# Altium project Austindetz_CM4_Board_v1.0.PrjPcb (part 2 of 2)

## Sheet Sheet4.SchDoc
size A3
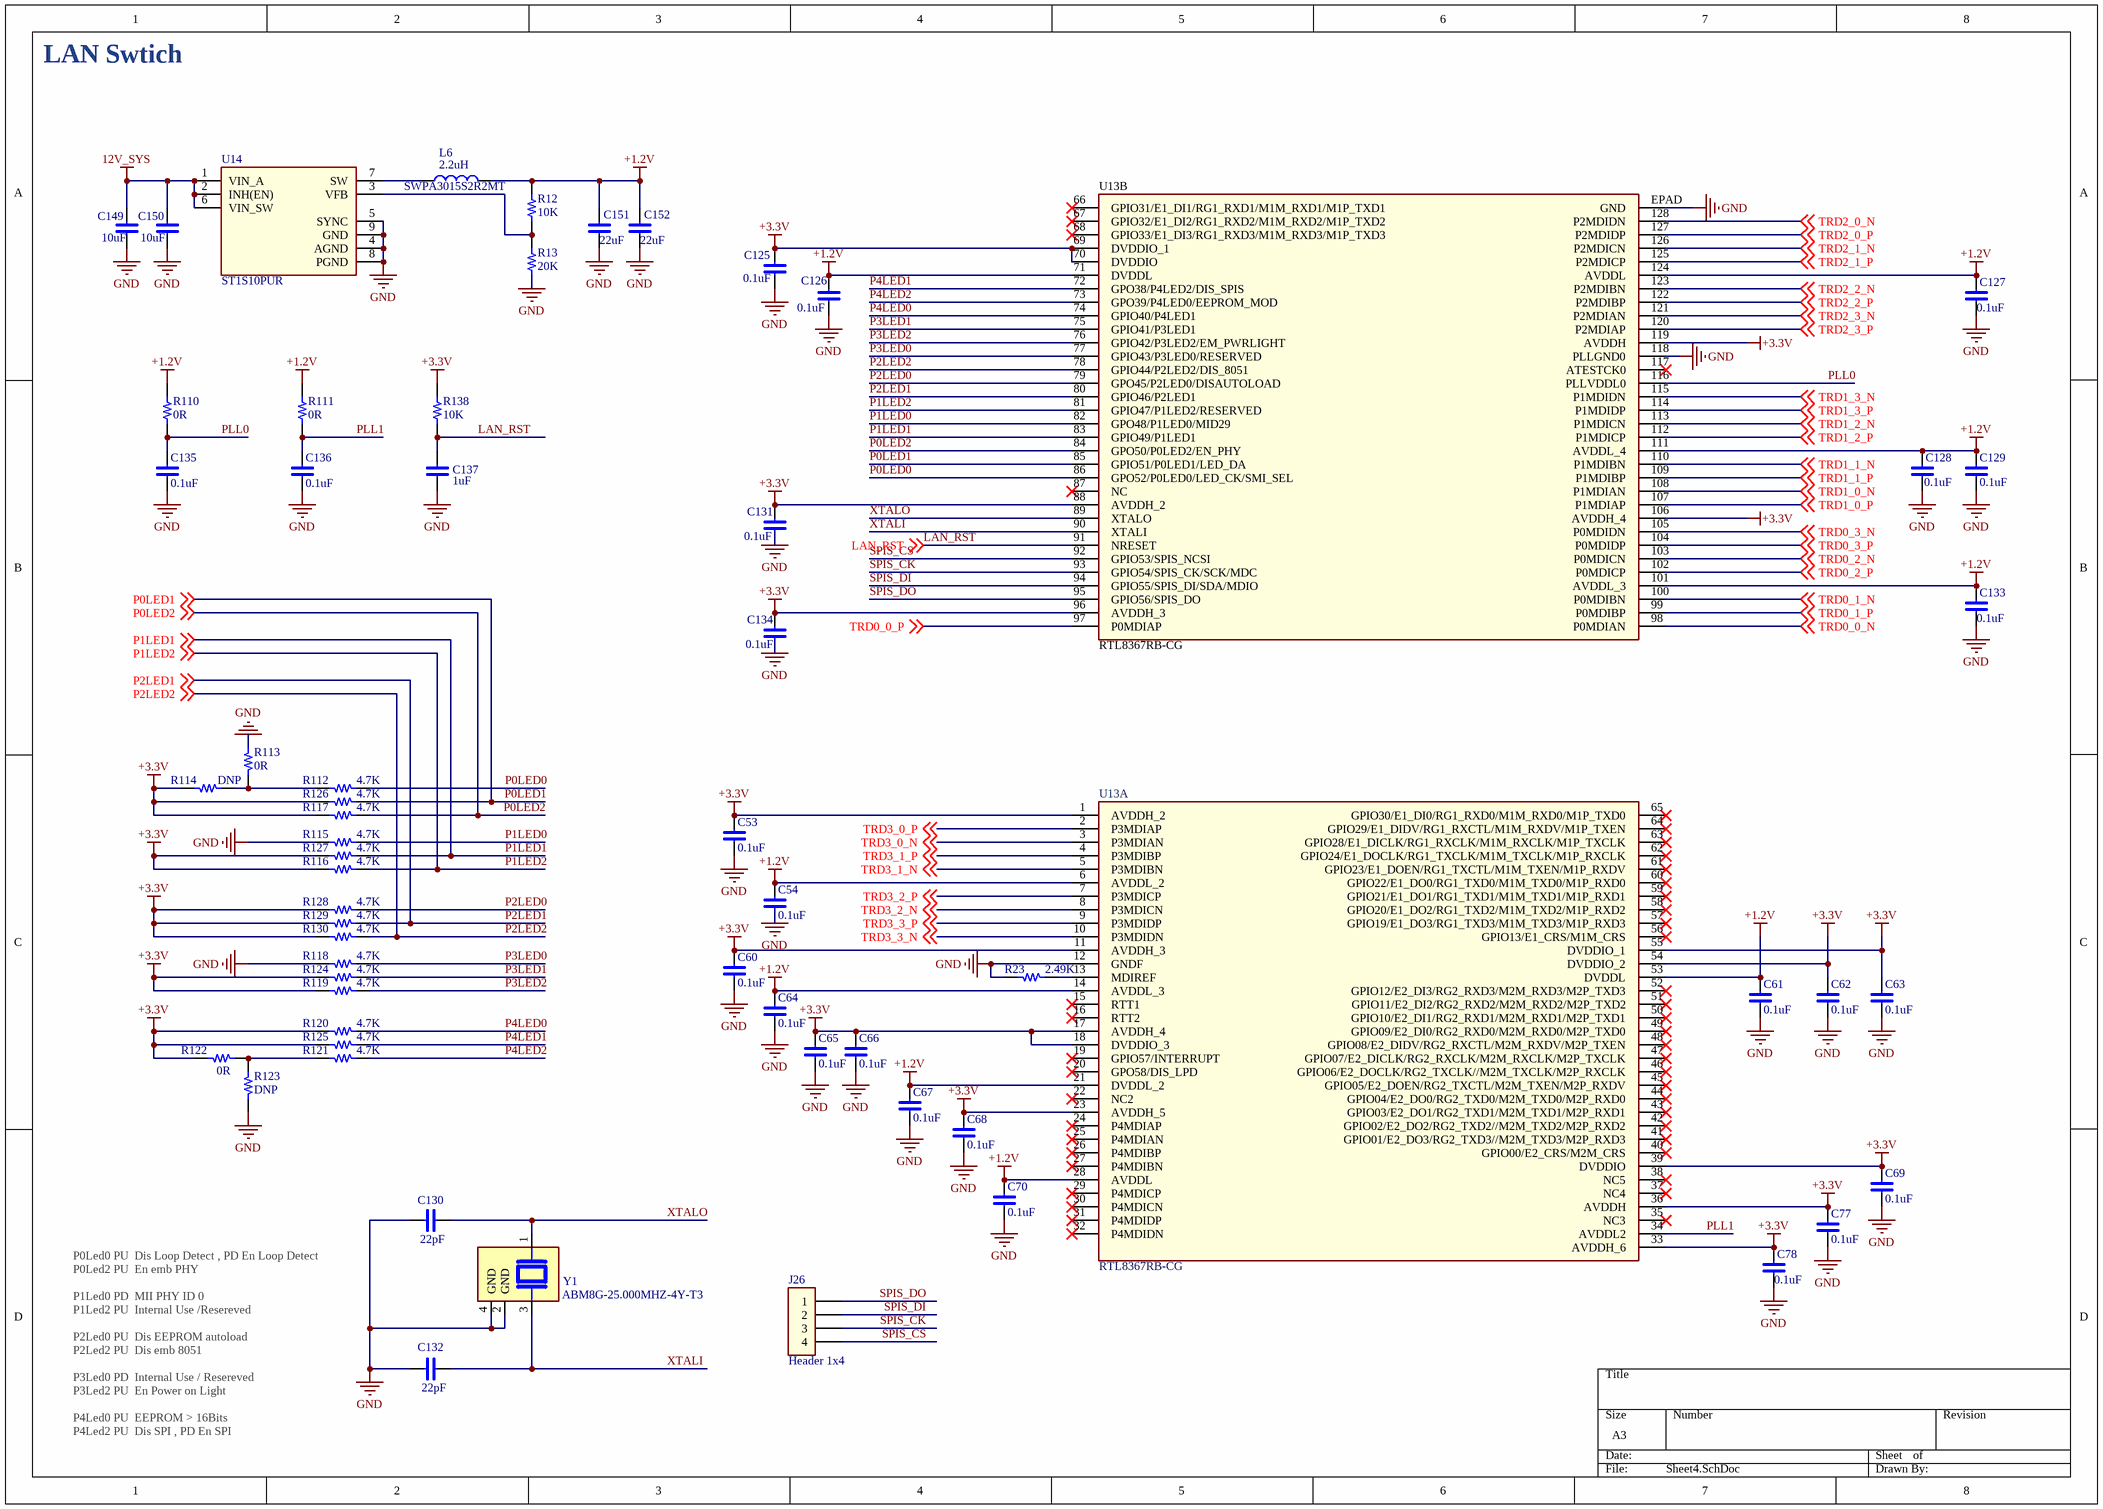
[diagram p3: Sheet4.SchDoc]

### Parts
C53  0.1uF  [C-0402/1005]
C54  0.1uF  [C-0402/1005]
C60  0.1uF  [C-0402/1005]
C61  0.1uF  [C-0402/1005]
C62  0.1uF  [C-0402/1005]
C63  0.1uF  [C-0402/1005]
C64  0.1uF  [C-0402/1005]
C65  0.1uF  [C-0402/1005]
C66  0.1uF  [C-0402/1005]
C67  0.1uF  [C-0402/1005]
C68  0.1uF  [C-0402/1005]
C69  0.1uF  [C-0402/1005]
C70  0.1uF  [C-0402/1005]
C77  0.1uF  [C-0402/1005]
C78  0.1uF  [C-0402/1005]
C125  0.1uF  [C-0402/1005]
C126  0.1uF  [C-0402/1005]
C127  0.1uF  [C-0402/1005]
C128  0.1uF  [C-0402/1005]
C129  0.1uF  [C-0402/1005]
C130  22pF  [C-0402/1005]
C131  0.1uF  [C-0402/1005]
C132  22pF  [C-0402/1005]
C133  0.1uF  [C-0402/1005]
C134  0.1uF  [C-0402/1005]
C135  0.1uF  [C-0402/1005]
C136  0.1uF  [C-0402/1005]
C137  1uF  [C-0402/1005]
C149  10uF  [C-0805/2012]
C150  10uF  [C-0805/2012]
C151  22uF  [C-0805/2012]
C152  22uF  [C-0805/2012]
J26  Header 1x4  [PIN HEADER 1x4 2.54mm]
L6  SWPA3015S2R2MT  value 2.2uH  [SWPA3015S2R2MT]
R12  10K  [R-0402/1005]
R13  20K  [R-0402/1005]
R23  2.49K  [R-0402/1005]
R110  0R  [R-0402/1005]
R111  0R  [R-0402/1005]
R112  4.7K  [R-0402/1005]
R113  0R  [R-0402/1005]
R114  DNP  [R-0402/1005]
R115  4.7K  [R-0402/1005]
R116  4.7K  [R-0402/1005]
R117  4.7K  [R-0402/1005]
R118  4.7K  [R-0402/1005]
R119  4.7K  [R-0402/1005]
R120  4.7K  [R-0402/1005]
R121  4.7K  [R-0402/1005]
R122  0R  [R-0402/1005]
R123  DNP  [R-0402/1005]
R124  4.7K  [R-0402/1005]
R125  4.7K  [R-0402/1005]
R126  4.7K  [R-0402/1005]
R127  4.7K  [R-0402/1005]
R128  4.7K  [R-0402/1005]
R129  4.7K  [R-0402/1005]
R130  4.7K  [R-0402/1005]
R138  10K  [R-0402/1005]
U13  RTL8367RB-CG  [LQFP128_EPAD_RTK]  (parts A,B of 2)
U14  ST1S10PUR  [DFN8_4X4_STM]
Y1  ABM8G-25.000MHZ-4Y-T3  [XTAL_ABM8G-25.000MHZ-4Y-T3]

### Nets
12V_SYS: C149.1 C150.1 U14.1(VIN_A) U14.2(INH(EN)) U14.6(VIN_SW)
+1.2V: C54.1 C61.1 C64.1 C67.1 C70.1 C126.1 C127.1 C128.1 C129.1 C133.1 C151.1 C152.1 L6.2 R12.2 R110.2 R111.2 U13.6(AVDDL_2) U13.14(AVDDL_3) U13.21(DVDDL_2) U13.28(AVDDL) U13.53(DVDDL) U13.71(DVDDL) U13.101(AVDDL_3) U13.111(AVDDL_4) U13.124(AVDDL)
+3.3V: C53.1 C60.1 C62.1 C63.1 C65.1 C66.1 C68.1 C69.1 C77.1 C78.1 C125.1 C131.1 C134.1 R114.2 R116.2 R117.2 R119.2 R120.2 R122.2 R124.2 R125.2 R126.2 R127.2 R128.2 R129.2 R130.2 R138.2 U13.1(AVDDH_2) U13.11(AVDDH_3) U13.17(AVDDH_4) U13.18(DVDDIO_3) U13.23(AVDDH_5) U13.33(AVDDH_6) U13.36(AVDDH) U13.39(DVDDIO) U13.54(DVDDIO_2) U13.55(DVDDIO_1) U13.69(DVDDIO_1) U13.70(DVDDIO) U13.88(AVDDH_2) U13.96(AVDDH_3) U13.106(AVDDH_4) U13.119(AVDDH)
GND: C53.2 C54.2 C60.2 C61.2 C62.2 C63.2 C64.2 C65.2 C66.2 C67.2 C68.2 C69.2 C70.2 C77.2 C78.2 C125.2 C126.2 C127.2 C128.2 C129.2 C130.1 C131.2 C132.1 C133.2 C134.2 C135.2 C136.2 C137.2 C149.2 C150.2 C151.2 C152.2 R13.2 R23.2 R113.2 R115.2 R118.2 R123.2 U13.12(GNDF) U13.118(PLLGND0) U13.EPAD(GND) U14.4(AGND) U14.5(SYNC) U14.8(PGND) U14.9(GND) Y1.2(GND) Y1.4(GND)
LAN_RST: C137.1 R138.1 U13.91(NRESET) ; off-sheet LAN_RST
P0LED0: R112.1 U13.86(GPO52/P0LED0/LED_CK/SMI_SEL)
P0LED1: R126.1 U13.85(GPIO51/P0LED1/LED_DA) ; off-sheet P0LED1
P0LED2: R117.1 U13.84(GPO50/P0LED2/EN_PHY) ; off-sheet P0LED2
P1LED0: R115.1 U13.82(GPO48/P1LED0/MID29)
P1LED1: R127.1 U13.83(GPIO49/P1LED1) ; off-sheet P1LED1
P1LED2: R116.1 U13.81(GPIO47/P1LED2/RESERVED) ; off-sheet P1LED2
P2LED0: R128.1 U13.79(GPO45/P2LED0/DISAUTOLOAD)
P2LED1: R129.1 U13.80(GPIO46/P2LED1) ; off-sheet P2LED1
P2LED2: R130.1 U13.78(GPIO44/P2LED2/DIS_8051) ; off-sheet P2LED2
P3LED0: R118.1 U13.77(GPIO43/P3LED0/RESERVED)
P3LED1: R124.1 U13.75(GPIO41/P3LED1)
P3LED2: R119.1 U13.76(GPIO42/P3LED2/EM_PWRLIGHT)
P4LED0: R120.1 U13.74(GPIO40/P4LED1)
P4LED1: R125.1 U13.72(GPO38/P4LED2/DIS_SPIS)
P4LED2: R121.1 U13.73(GPO39/P4LED0/EEPROM_MOD)
PLL0: C135.1 R110.1 U13.116(PLLVDDL0)
PLL1: C136.1 R111.1 U13.34(AVDDL2)
SPIS_CK: J26.3 U13.93(GPIO54/SPIS_CK/SCK/MDC)
SPIS_CS: J26.4 U13.92(GPIO53/SPIS_NCSI)
SPIS_DI: J26.2 U13.94(GPIO55/SPIS_DI/SDA/MDIO)
SPIS_DO: J26.1 U13.95(GPIO56/SPIS_DO)
TRD0_0_N: U13.98(P0MDIAN) ; off-sheet TRD0_0_N
TRD0_0_P: U13.97(P0MDIAP) ; off-sheet TRD0_0_P
TRD0_1_N: U13.100(P0MDIBN) ; off-sheet TRD0_1_N
TRD0_1_P: U13.99(P0MDIBP) ; off-sheet TRD0_1_P
TRD0_2_N: U13.103(P0MDICN) ; off-sheet TRD0_2_N
TRD0_2_P: U13.102(P0MDICP) ; off-sheet TRD0_2_P
TRD0_3_N: U13.105(P0MDIDN) ; off-sheet TRD0_3_N
TRD0_3_P: U13.104(P0MDIDP) ; off-sheet TRD0_3_P
TRD1_0_N: U13.108(P1MDIAN) ; off-sheet TRD1_0_N
TRD1_0_P: U13.107(P1MDIAP) ; off-sheet TRD1_0_P
TRD1_1_N: U13.110(P1MDIBN) ; off-sheet TRD1_1_N
TRD1_1_P: U13.109(P1MDIBP) ; off-sheet TRD1_1_P
TRD1_2_N: U13.113(P1MDICN) ; off-sheet TRD1_2_N
TRD1_2_P: U13.112(P1MDICP) ; off-sheet TRD1_2_P
TRD1_3_N: U13.115(P1MDIDN) ; off-sheet TRD1_3_N
TRD1_3_P: U13.114(P1MDIDP) ; off-sheet TRD1_3_P
TRD2_0_N: U13.128(P2MDIDN) ; off-sheet TRD2_0_N
TRD2_0_P: U13.127(P2MDIDP) ; off-sheet TRD2_0_P
TRD2_1_N: U13.126(P2MDICN) ; off-sheet TRD2_1_N
TRD2_1_P: U13.125(P2MDICP) ; off-sheet TRD2_1_P
TRD2_2_N: U13.123(P2MDIBN) ; off-sheet TRD2_2_N
TRD2_2_P: U13.122(P2MDIBP) ; off-sheet TRD2_2_P
TRD2_3_N: U13.121(P2MDIAN) ; off-sheet TRD2_3_N
TRD2_3_P: U13.120(P2MDIAP) ; off-sheet TRD2_3_P
TRD3_0_N: U13.3(P3MDIAN) ; off-sheet TRD3_0_N
TRD3_0_P: U13.2(P3MDIAP) ; off-sheet TRD3_0_P
TRD3_1_N: U13.5(P3MDIBN) ; off-sheet TRD3_1_N
TRD3_1_P: U13.4(P3MDIBP) ; off-sheet TRD3_1_P
TRD3_2_N: U13.8(P3MDICN) ; off-sheet TRD3_2_N
TRD3_2_P: U13.7(P3MDICP) ; off-sheet TRD3_2_P
TRD3_3_N: U13.10(P3MDIDN) ; off-sheet TRD3_3_N
TRD3_3_P: U13.9(P3MDIDP) ; off-sheet TRD3_3_P
XTALI: C132.2 U13.90(XTALI) Y1.3
XTALO: C130.2 U13.89(XTALO) Y1.1
NetL6_1: L6.1 U14.7(SW)
NetR12_1: R12.1 R13.1 U14.3(VFB)
NetR23_1: R23.1 U13.13(MDIREF)
NetR112_2: R112.2 R113.1 R114.1
NetR121_2: R121.2 R122.1 R123.1

Not connected (* = marked no-connect by the designer): U13 15(RTT1)* 16(RTT2)* 19(GPIO57/INTERRUPT)* 20(GPO58/DIS_LPD)* 22(NC2)* 24(P4MDIAP)* 25(P4MDIAN)* 26(P4MDIBP)* 27(P4MDIBN)* 29(P4MDICP)* 30(P4MDICN)* 31(P4MDIDP)* 32(P4MDIDN)* 35(NC3)* 37(NC4)* 38(NC5)* 40(GPIO00/E2_CRS/M2M_CRS)* 41(GPIO01/E2_DO3/RG2_TXD3//M2M_TXD3/M2P_RXD3)* 42(GPIO02/E2_DO2/RG2_TXD2//M2M_TXD2/M2P_RXD2)* 43(GPIO03/E2_DO1/RG2_TXD1/M2M_TXD1/M2P_RXD1)* 44(GPIO04/E2_DO0/RG2_TXD0/M2M_TXD0/M2P_RXD0)* 45(GPIO05/E2_DOEN/RG2_TXCTL/M2M_TXEN/M2P_RXDV)* 46(GPIO06/E2_DOCLK/RG2_TXCLK//M2M_TXCLK/M2P_RXCLK)* 47(GPIO07/E2_DICLK/RG2_RXCLK/M2M_RXCLK/M2P_TXCLK)* 48(GPIO08/E2_DIDV/RG2_RXCTL/M2M_RXDV/M2P_TXEN)* 49(GPIO09/E2_DI0/RG2_RXD0/M2M_RXD0/M2P_TXD0)* 50(GPIO10/E2_DI1/RG2_RXD1/M2M_RXD1/M2P_TXD1)* 51(GPIO11/E2_DI2/RG2_RXD2/M2M_RXD2/M2P_TXD2)* 52(GPIO12/E2_DI3/RG2_RXD3/M2M_RXD3/M2P_TXD3)* 56(GPIO13/E1_CRS/M1M_CRS)* 57(GPIO19/E1_DO3/RG1_TXD3/M1M_TXD3/M1P_RXD3)* 58(GPIO20/E1_DO2/RG1_TXD2/M1M_TXD2/M1P_RXD2)* 59(GPIO21/E1_DO1/RG1_TXD1/M1M_TXD1/M1P_RXD1)* 60(GPIO22/E1_DO0/RG1_TXD0/M1M_TXD0/M1P_RXD0)* 61(GPIO23/E1_DOEN/RG1_TXCTL/M1M_TXEN/M1P_RXDV)* 62(GPIO24/E1_DOCLK/RG1_TXCLK/M1M_TXCLK/M1P_RXCLK)* 63(GPIO28/E1_DICLK/RG1_RXCLK/M1M_RXCLK/M1P_TXCLK)* 64(GPIO29/E1_DIDV/RG1_RXCTL/M1M_RXDV/M1P_TXEN)* 65(GPIO30/E1_DI0/RG1_RXD0/M1M_RXD0/M1P_TXD0)* 66(GPIO31/E1_DI1/RG1_RXD1/M1M_RXD1/M1P_TXD1)* 67(GPIO32/E1_DI2/RG1_RXD2/M1M_RXD2/M1P_TXD2)* 68(GPIO33/E1_DI3/RG1_RXD3/M1M_RXD3/M1P_TXD3)* 87(NC)* 117(ATESTCK0)*

### Notes on the sheet
- LAN Swtich
- P0Led0 PU  Dis Loop Detect , PD En Loop Detect
  P0Led2 PU  En emb PHY
  P1Led0 PD  MII PHY ID 0
  P1Led2 PU  Internal Use /Resereved
  P2Led0 PU  Dis EEPROM autoload
  P2Led2 PU  Dis emb 8051
  P3Led0 PD  Internal Use / Resereved
  P3Led2 PU  En Power on Light
  P4Led0 PU  EEPROM > 16Bits
  P4Led2 PU  Dis SPI , PD En SPI

### Library data of the parts
C53 C54 C60-C70 C77 C78 C125-C137 = Capacitor-NonPolar: CAP CER 0.1UF 16V X7R 0402; Mfr. Part No.: GCM155R71C104KA55D; Unit Price (USD): 0.1; Value: 0.1uF 16V; Supplier Part No.: 490-4759-1-ND; Supplier: Digikey Electronics
C149-C152 = CAP 1206/3216: CAP CER 10UF 25V X5R 1206; Mfr. Part No.: C1206C106M3PACTU; Unit Price (USD): 0.28; Supplier Part No.: 399-8153-1-ND; Supplier: Digikey Electronics
J26 = Header 1x4: CONN HEADER VERT 4POS 2.54MM; Supplier: Digikey Electronics
L6 = 4.3x4.3mm: FIXED IND 22UH 620MA 350 MOHM; Mfr. Part No.: ASPI-4020S-220M-T; Unit Price (USD): 0.48; Supplier Part No.: 535-12307-1-ND; Supplier: Digikey Electronics
R12 R13 R23 = Resistor: as R15 on sheet Sheet2; Supplier Part No.: P51DECT-ND; Supplier: Digikey Electronics
R110-R130 R138 = Resistor: RES SMD 1K OHM 1% 1/16W 0402; Mfr. Part No.: RC0402FR-071KL; Unit Price (USD): 0.1; Value: 1k; Supplier Part No.: 311-1.00KLRCT-ND; Supplier: Digikey Electronics
U13 = RTL8367RB-CG: MFR_NAME: Realtek; GateName_1: A; SymbolName_1: RTL8367RB-CG_PARTA; GateName_2: B; SymbolName_2: RTL8367RB-CG_PARTB; LibraryName: RTL8367RB; DeviceSetName: RTL8367RB-CG; Package: LQFP128_EPAD_RTK; COPYRIGHT: Copyright (C) 2023 Ultra Librarian. All rights reserved.; MANUFACTURER_PART_NUMBER: RTL8367RB-CG
U14 = ST1S10PUR: No Description Available; Mfr_Name: STMicroelectronics; RefDes: RefDes; Type: Type
Y1 = ABM8G-25.000MHZ-4Y-T3: 25 MHz Â±30ppm Crystal 10pF 60 Ohms 4-SMD, No Lead; MF: Abracon; Price: None; Value: *; Check_prices: https://www.snapeda.com/parts/ABM8G-25.000MHZ-4Y-T3/Abracon+LLC/view-part/?ref=eda; Purchase-URL: https://pricing.snapeda.com/search/part/ABM8G-25.000MHZ-4Y-T3/?ref=eda; Package: SMD-4 Abracon; SnapEDA_Link: https://www.snapeda.com/parts/ABM8G-25.000MHZ-4Y-T3/Abracon+LLC/view-part/?ref=snap; Availability: In Stock; MP: ABM8G-25.000MHZ-4Y-T3

## Sheet Sheet5.SchDoc
size A3; SPICEModelCacheJPNMEEMH: <root> / <DocumentId>JPNMEEMH</DocumentId> / <CacheFrame Number="0"> / <Model Name="zener" Kind="MDL"> / <Text>*ZENER / *Default Zener 10V @ 10mA / *Zener Diode Pinout: A,K / .MODEL ZENER D( BV=10 IBV=10E-3 )</Text> / </Model> / <Model Name="led0" Kind="MDL"> / <Text>*Typ INFRARED GaAs LED: Vf=1.2V Vr=5V If=40mA trr=3uS / *LED Pinout: 1=A, 2=K / .MODEL LED0 D (IS=93.5P RS=84M N=2.63 BV=5 IBV=10U / + CJO=2.97P VJ=.75 M=.333 TT=4.32U)</Text> / </Model> / </CacheFrame> / </root>
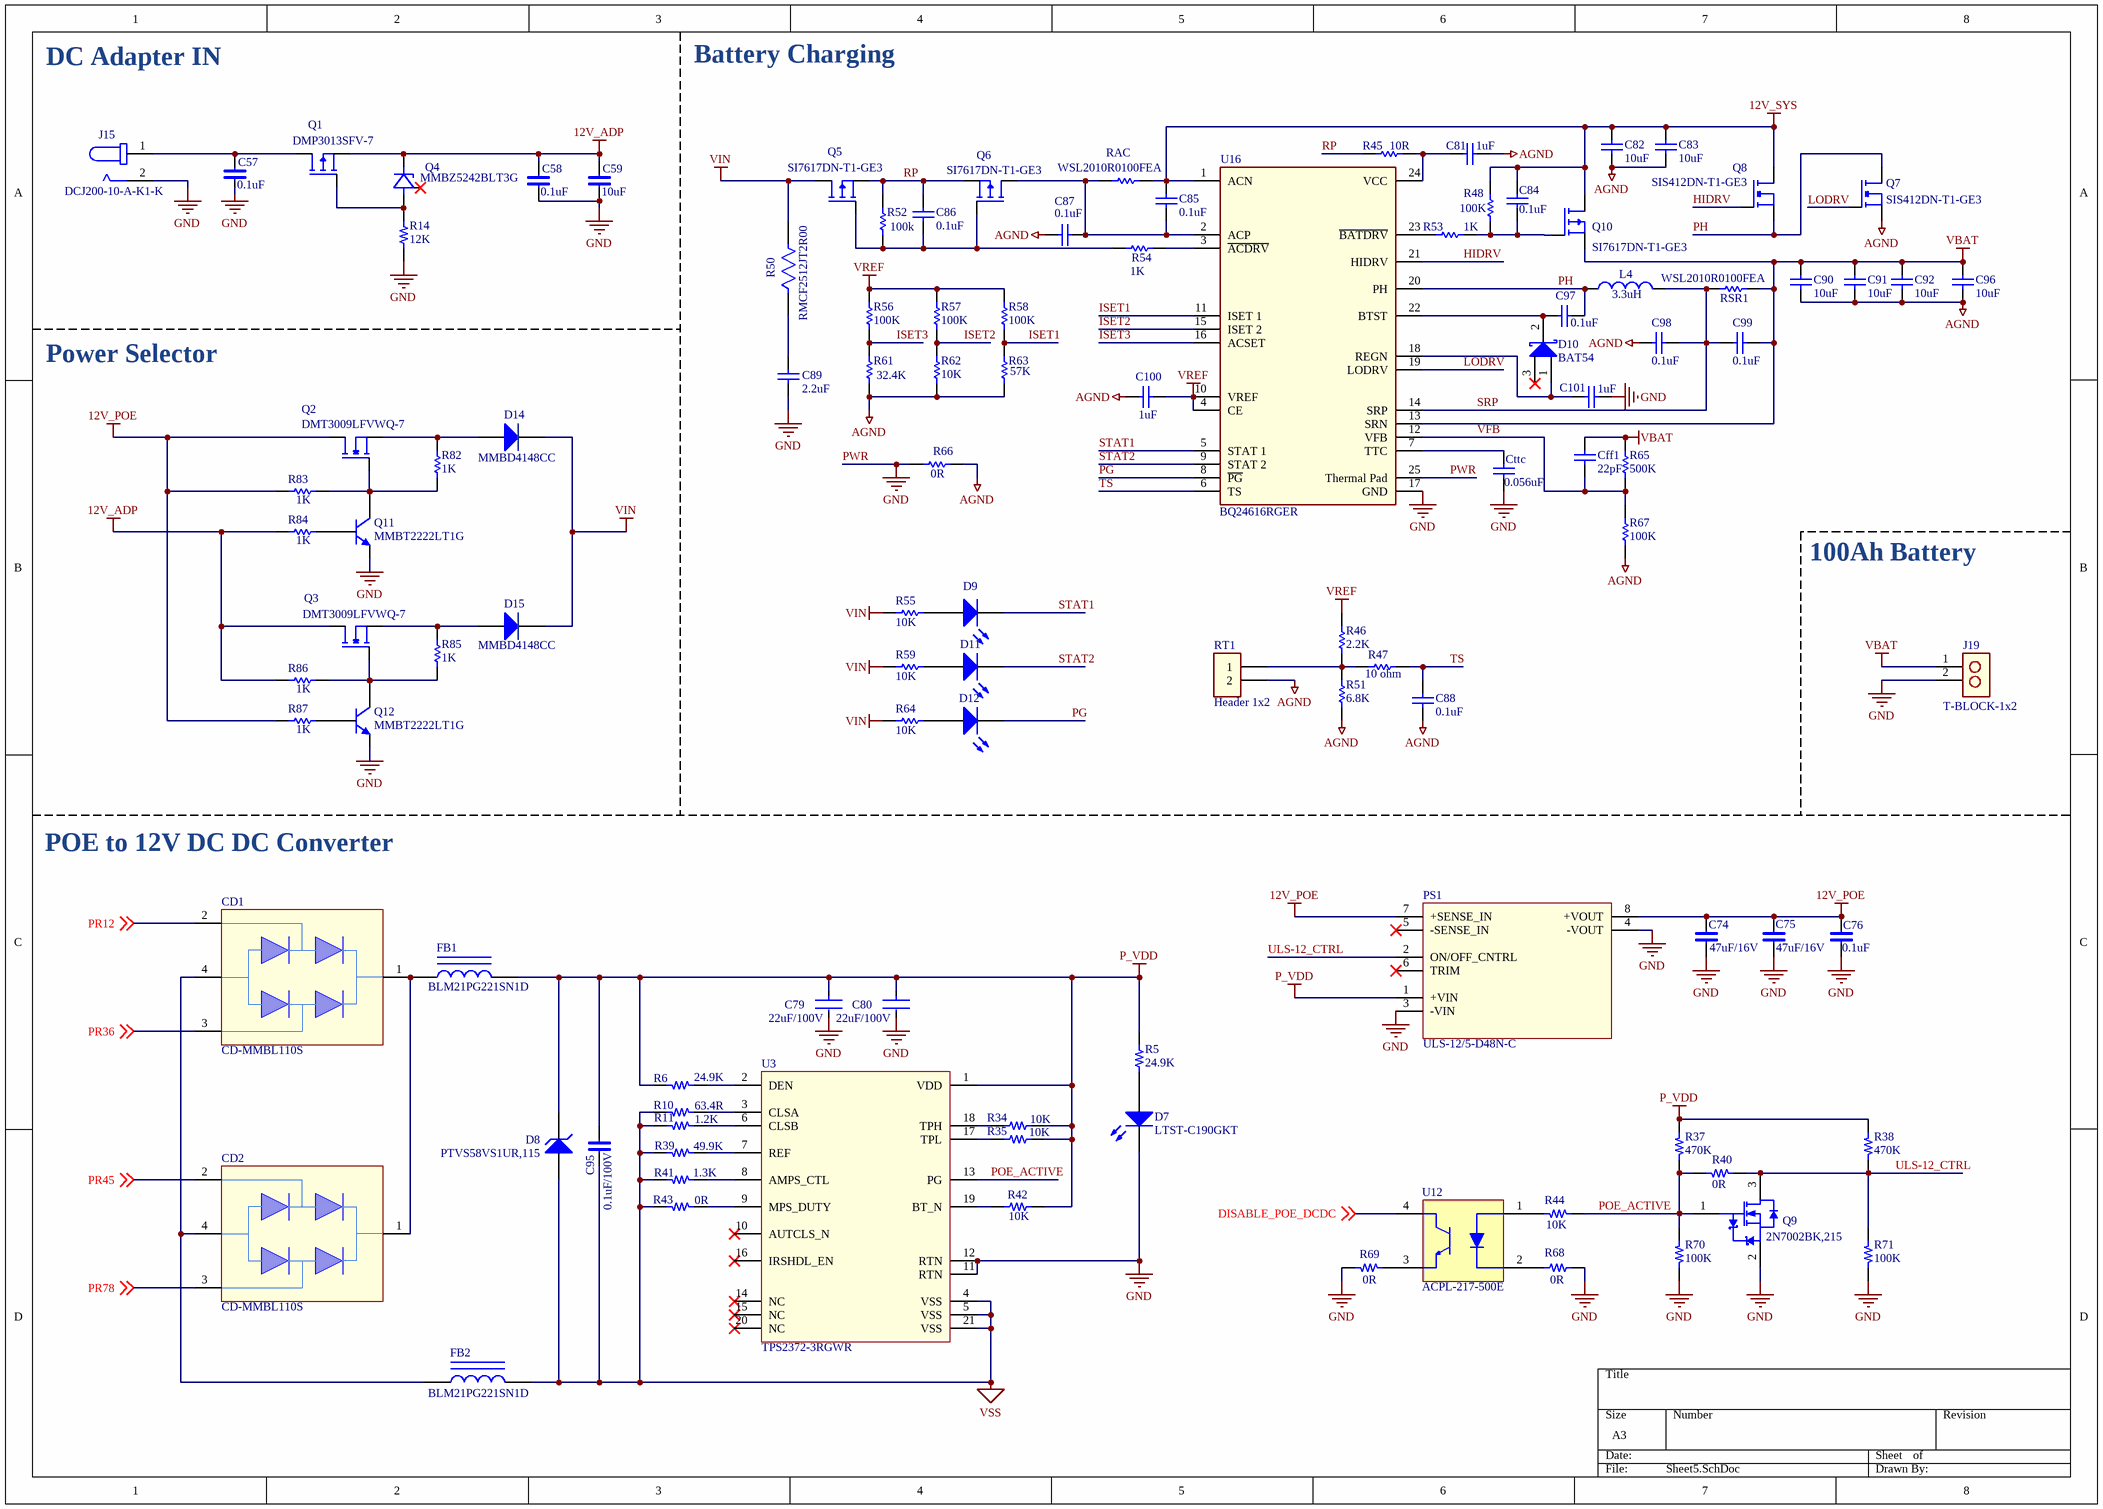
[diagram p4: Sheet5.SchDoc]

### Parts
C57  0.1uF  [C-0603/1608]
C58  0.1uF  [C-0603/1608]
C59  10uF  [C-1206/3216]
C74  47uF/16V  [C-1206/3216]
C75  47uF/16V  [C-1206/3216]
C76  0.1uF  [C-0402/1005]
C79  22uF/100V  [FP-KRM55W-6_1_5_3_6_7_1_2-MFG]
C80  22uF/100V  [FP-KRM55W-6_1_5_3_6_7_1_2-MFG]
C81  value 1uF  [C-0603/1608]  (hidden comment: Capacitor)
C82  value 10uF  [C-0805/2012]  (hidden comment: Capacitor)
C83  value 10uF  [C-0805/2012]  (hidden comment: Capacitor)
C84  value 0.1uF  [R-0402/1005]  (hidden comment: Capacitor)
C85  value 0.1uF  [C-0402/1005]  (hidden comment: Capacitor)
C86  value 0.1uF  [C-0402/1005]  (hidden comment: Capacitor)
C87  value 0.1uF  [C-0402/1005]  (hidden comment: Capacitor)
C88  value 0.1uF  [C-0402/1005]  (hidden comment: Capacitor)
C89  value 2.2uF  [C1206]  (hidden comment: Capacitor)
C90  value 10uF  [C-0805/2012]  (hidden comment: Capacitor)
C91  value 10uF  [C-0805/2012]  (hidden comment: Capacitor)
C92  value 10uF  [C-0805/2012]  (hidden comment: Capacitor)
C95  0.1uF/100V  [C-0402/1005]
C96  value 10uF  [C-0805/2012]  (hidden comment: Capacitor)
C97  value 0.1uF  [C-0402/1005]  (hidden comment: Capacitor)
C98  value 0.1uF  [C-0402/1005]  (hidden comment: Capacitor)
C99  value 0.1uF  [C-0402/1005]  (hidden comment: Capacitor)
C100  value 1uF  [C-0603/1608]  (hidden comment: Capacitor)
C101  value 1uF  [C-0603/1608]  (hidden comment: Capacitor)
CD1  CD-MMBL110S  [CD-MMBL110S]  (value not drawn)
CD2  CD-MMBL110S  [CD-MMBL110S]  (value not drawn)
Cff1  value 22pF  [C-0402/1005]  (hidden comment: Capacitor)
Cttc  value 0.056uF  [C-1206/3216]  (hidden comment: Capacitor)
D7  LTST-C190GKT  [LEDC1608X35N]
D8  PTVS58VS1UR,115  [DIO_PMEG4030ER,115]
D9  LED  [LED-0402-GREEN]  (value not drawn)
D10  BAT54  [SOT-23-3]
D11  LED  [LED-0402-GREEN]  (value not drawn)
D12  LED  [LED-0402-GREEN]  (value not drawn)
D14  MMBD4148CC  [SOT-23-3]
D15  MMBD4148CC  [SOT-23-3]
FB1  BLM21PG221SN1D  [BEADC2012X105N]
FB2  BLM21PG221SN1D  [BEADC2012X105N]
J15  DCJ200-10-A-K1-K  [GCT_DCJ200-10-A-XX-X_REVA]
J19  T-BLOCK-1x2  [Terminal Block-1x2-5.08mm]
L4  value 3.3uH  [IND_SRN6045TA-3R3Y]  (hidden comment: Inductor)
PS1  ULS-12/5-D48N-C  [CONV_ULS-12/5-D48N-C]
Q1  DMP3013SFV-7  [POWERDI3333-8_UX_DIO]
Q2  DMT3009LFVWQ-7  [POWERDI3333-8_UX_DIO]
Q3  DMT3009LFVWQ-7  [POWERDI3333-8_UX_DIO]
Q4  MMBZ5242BLT3G  [SOT-23-3]
Q5  SI7617DN-T1-GE3  [POWERDI3333-8_UX_DIO]
Q6  SI7617DN-T1-GE3  [POWERDI3333-8_UX_DIO]
Q7  SIS412DN-T1-GE3  [POWERDI3333-8_UX_DIO]
Q8  SIS412DN-T1-GE3  [POWERDI3333-8_UX_DIO]
Q9  2N7002BK,215  [NXP-SOT23_M]
Q10  SI7617DN-T1-GE3  [POWERDI3333-8_UX_DIO]
Q11  MMBT2222LT1G  [SOT-23-3]
Q12  MMBT2222LT1G  [SOT-23-3]
R5  24.9K  [R-0402/1005]
R6  24.9K  [R-0402/1005]
R10  63.4R  [R-0402/1005]
R11  1.2K  [R-0402/1005]
R14  12K  [R-0402/1005]
R34  10K  [R-0402/1005]
R35  10K  [R-0402/1005]
R37  470K  [R-0402/1005]
R38  470K  [R-0402/1005]
R39  49.9K  [R-0402/1005]
R40  0R  [R-0402/1005]
R41  1.3K  [R-0402/1005]
R42  10K  [R-0402/1005]
R43  0R  [R-0402/1005]
R44  10K  [R-0402/1005]
R45  value 10R  [R-0805/2012]  (hidden comment: Resistor)
R46  value 2.2K  [R-0402/1005]  (hidden comment: Resistor)
R47  value 10 ohm  [R-0402/1005]  (hidden comment: Resistor)
R48  value 100K  [R-0402/1005]  (hidden comment: Resistor)
R50  RMCF2512JT2R00  [FP-RMCF2512-IPC_A]
R51  value 6.8K  [R-0402/1005]  (hidden comment: Resistor)
R52  value 100k  [R-0402/1005]  (hidden comment: Resistor)
R53  value 1K  [R-0402/1005]  (hidden comment: Resistor)
R54  1K  [R-0402/1005]
R55  value 10K  [R-0402/1005]  (hidden comment: Resistor)
R56  value 100K  [R-0402/1005]  (hidden comment: Resistor)
R57  value 100K  [R-0402/1005]  (hidden comment: Resistor)
R58  value 100K  [R-0402/1005]  (hidden comment: Resistor)
R59  value 10K  [R-0402/1005]  (hidden comment: Resistor)
R61  value 32.4K  [R-0402/1005]  (hidden comment: Resistor)
R62  value 10K  [R-0402/1005]  (hidden comment: Resistor)
R63  value 57K  [R-0402/1005]  (hidden comment: Resistor)
R64  value 10K  [R-0402/1005]  (hidden comment: Resistor)
R65  value 500K  [R-0402/1005]  (hidden comment: Resistor)
R66  value 0R  [R-1210]  (hidden comment: Resistor)
R67  value 100K  [R-0402/1005]  (hidden comment: Resistor)
R68  0R  [R-0402/1005]
R69  0R  [R-0402/1005]
R70  100K  [R-0402/1005]
R71  100K  [R-0402/1005]
R82  1K  [R-0402/1005]
R83  1K  [R-0402/1005]
R84  1K  [R-0402/1005]
R85  1K  [R-0402/1005]
R86  1K  [R-0402/1005]
R87  1K  [R-0402/1005]
RAC  WSL2010R0100FEA  [RESC5125X89X51LL25T25]
RSR1  WSL2010R0100FEA  [RESC5125X89X51LL25T25]
RT1  Header 1x2  [PIN HEADER 1x2 2.54mm]
U3  TPS2372-3RGWR  [QFN65P500X500X100-21N]
U12  ACPL-217-500E  [AVAG-ACPL-217-4_M]
U16  BQ24616RGER  [QFN50P400X400X100-25N]

### Nets
12V_ADP: C58.1 C59.1 Q1.S Q3.D Q4.3 R84.1 R86.1
12V_POE: C74.1 C75.1 C76.1 PS1.7(+SENSE_IN) PS1.8(+VOUT) Q2.D R83.1 R87.1
12V_SYS: C82.1 C83.1 C84.2 C85.2 Q8.D Q10.D R48.2 RAC.2 U16.1(ACN)
AGND: C81.2 C82.2 C83.2 C87.1 C88.1 C90.2 C91.2 C92.2 C96.2 C98.2 C100.1 Q7.S R51.2 R61.2 R62.2 R63.2 R66.1 R67.1 RT1.2
GND: C57.2 C58.2 C59.2 C74.2 C75.2 C76.2 C79.2 C80.2 C89.1 C101.2 Cttc.2 D7.C J15.2 J19.2 PS1.3(-VIN) PS1.4(-VOUT) Q9.2(S) Q11.1(E) Q12.1(E) R14.1 R66.2 R68.1 R69.1 R70.2 R71.2 U3.11(RTN) U3.12(RTN) U16.17(GND) U16.25(Thermal_Pad)  [also labelled PWR]
P_VDD: C79.1 C80.1 C95.1 D8.2(K) FB1.2 PS1.1(+VIN) R5.1 R6.2 R34.2 R35.2 R37.1 R38.1 R42.2 U3.1(VDD)
VBAT: C90.1 C91.1 C92.1 C96.1 C99.1 Cff1.2 J19.1 Q10.S R65.2 RSR1.2 U16.13(SRN)
VIN: D14.2(K) D15.2(K) Q5.D R50.2 R55.2 R59.2 R64.2
VREF: C100.2 R46.1 R56.1 R57.1 R58.1 U16.4(CE) U16.10(VREF)
VSS: C95.2 D8.1(A) FB2.2 R10.2 R11.2 R39.2 R41.2 R43.2 U3.4(VSS) U3.5(VSS) U3.21(VSS)
DISABLE_POE_DCDC: U12.4(COLLECTOR) ; off-sheet DISABLE_POE_DCDC
HIDRV: Q8.G U16.21(HIDRV)
ISET1: R58.2 R63.1 U16.11(ISET_1)
ISET2: R57.2 R62.1 U16.15(ISET_2)
ISET3: R56.2 R61.1 U16.16(ACSET)
LODRV: Q7.G U16.19(LODRV)
PG: D12.2 U16.8(~{PG})
PH: C97.1 L4.1 Q7.D Q8.S U16.20(PH)
POE_ACTIVE: Q9.1(G) R37.2 R40.1 R44.1 R70.1 U3.13(PG)
PR12: CD1.2 ; off-sheet PR12
PR36: CD1.3 ; off-sheet PR36
PR45: CD2.2 ; off-sheet PR45
PR78: CD2.3 ; off-sheet PR78
RP: C86.2 Q5.S Q6.S R45.1 R52.2
SRP: C98.1 C99.2 L4.2 RSR1.1 U16.14(SRP)
STAT1: D9.2 U16.5(STAT_1)
STAT2: D11.2 U16.9(STAT_2)
TS: C88.2 R47.1 U16.6(TS)
ULS-12_CTRL: PS1.2(ON/OFF_CNTRL) Q9.3(D) R38.2 R40.2 R71.1
VFB: Cff1.1 R65.1 R67.2 U16.12(VFB)
NetC57_1: C57.1 J15.1 Q1.D
NetC81_1: C81.1 R45.2 U16.24(VCC)
NetC84_1: C84.1 Q10.G R48.1 R53.1
NetC85_1: C85.1 C87.2 Q6.D RAC.1 U16.2(ACP)
NetC86_1: C86.1 Q5.G Q6.G R52.1 R54.1
NetC89_2: C89.2 R50.1
NetC97_2: C97.2 D10.2 U16.22(BTST)
NetC101_1: C101.1 D10.1 U16.18(REGN)
NetCD1_1: CD1.1 CD2.1 FB1.1
NetCD1_4: CD1.4 CD2.4 FB2.1
NetCttc_1: Cttc.1 U16.7(TTC)
NetD7_A: D7.A R5.2
NetD9_1: D9.1 R55.1
NetD11_1: D11.1 R59.1
NetD12_1: D12.1 R64.1
NetD14_1: D14.1(A) Q2.S R82.2
NetD15_1: D15.1(A) Q3.S R85.2
NetQ1_G: Q1.G Q4.1 R14.2
NetQ2_G: Q2.G Q11.3(C) R82.1 R83.2
NetQ3_G: Q3.G Q12.3(C) R85.1 R86.2
NetQ11_2: Q11.2(B) R84.2
NetQ12_2: Q12.2(B) R87.2
NetR6_1: R6.1 U3.2(DEN)
NetR10_1: R10.1 U3.3(CLSA)
NetR11_1: R11.1 U3.6(CLSB)
NetR34_1: R34.1 U3.18(TPH)
NetR35_1: R35.1 U3.17(TPL)
NetR39_1: R39.1 U3.7(REF)
NetR41_1: R41.1 U3.8(AMPS_CTL)
NetR42_1: R42.1 U3.19(BT_N)
NetR43_1: R43.1 U3.9(MPS_DUTY)
NetR44_2: R44.2 U12.1(ANODE)
NetR46_2: R46.2 R47.2 R51.1 RT1.1
NetR53_2: R53.2 U16.23(~{BATDRV})
NetR54_2: R54.2 U16.3(~{ACDRV})
NetR68_2: R68.2 U12.2(CATHODE)
NetR69_2: R69.2 U12.3(EMITTRE)

Not connected (* = marked no-connect by the designer): D10 3*; PS1 5(-SENSE_IN)* 6(TRIM)*; Q4 2*; U3 10(AUTCLS_N)* 14(NC)* 15(NC)* 16(IRSHDL_EN)* 20(NC)*

### Notes on the sheet
- DC Adapter IN
- Battery Charging
- Power Selector
- 100Ah Battery
- POE to 12V DC DC Converter

### Library data of the parts
C57-C59 = Capacitor-NonPolar: CAP CER 10UF 10V X7R 0805; Mfr. Part No.: GRM21BR71A106KA73K; Unit Price (USD): 0.19; Value: 10uF 10V; Supplier Part No.: 490-14381-1-ND; Supplier: Digikey Electronics
C74-C76 C95 = Capacitor-NonPolar: CAP CER 0.1UF 50V X7R 0402; Mfr. Part No.: UMK105B7104KV-FR; Value: 100nF; Unit Price (USD): 0.15; Supplier Part No.: 587-3498-1-ND; Supplier: Digikey Electronics
C79 C80 = CMP-06035-058120-1: Cap Ceramic 22uF 100V X7R ±15% SMD 2220 +125°C Emboss T/R; Tolerance: 20%; Lead/Base Style: J-Lead; Min Operating Temperature: -55°C; Case/Package: SMD/SMT; Voltage Rating: 100V; Capacitance: 22uF; Mount: Surface Mount; Packaging: Tape and Reel; Max Operating Temperature: 125°C
D7 = LED0: Typical INFRARED GaAs LED; Published: 8-Jun-2000; LatestRevisionDate: 08-Jul-2005; LatestRevisionNote: Mech Layer 1 removed.; PackageReference: LED-0; Publisher: Altium Limited; PackageDescription: LED; 2 Leads
D8 = D Zener: Zener Diode; Published: 8-Jun-2000; LatestRevisionDate: 17-Jul-2002; LatestRevisionNote: Re-released for DXP Platform.; PackageReference: DIODE-0.7; Publisher: Altium Limited; PackageDescription: Diode, Thru-Hole; 2 Leads; 0.7 in Pin Spacing
D9 D11 D12 = LED: Typical INFRARED GaAs LED; Published: 8-Jun-2000; LatestRevisionDate: 08-Jul-2005; LatestRevisionNote: Mech Layer 1 removed.; PackageReference: LED-0; Publisher: Altium Limited; PackageDescription: LED; 2 Leads
D10 = Diode Schottky_1: Schottky Diode; Published: 8-Jun-2000; LatestRevisionDate: 17-Jul-2002; LatestRevisionNote: Re-released for DXP Platform.; PackageReference: SMB; Publisher: Altium Limited; PackageDescription: DO-214-AA/SMB; 2 C-Bend Leads; Body 5.3 x 3.6 mm, inc. leads (LxW); Code_JEDEC: DO-214-AA
D14 D15 = Diode GENERAL: Published: 8-Jun-2000; LatestRevisionDate: 17-Jul-2002; LatestRevisionNote: Re-released for DXP Platform.; PackageReference: SMB; Publisher: Altium Limited; PackageDescription: DO-214-AA/SMB; 2 C-Bend Leads; Body 5.3 x 3.6 mm, inc. leads (LxW); Code_JEDEC: DO-214-AA
FB1 FB2 = Inductor Iron: Magnetic-Core Inductor; Published: 24-Mar-1999; LatestRevisionDate: 17-Jul-2002; LatestRevisionNote: Re-released for DXP Platform.; PackageReference: AXIAL-0.9; Publisher: Altium Limited; PackageDescription: Axial Device, Thru-Hole; 2 Leads; 0.9 in Pin Spacing
J15 = DC Jack: CONN PWR JACK 2X5.5MM SOLDER; Mfr. Part No.: PJ-037AH; Unit Price (USD): 0.71; Supplier Part No.: CP-037AH-ND; Supplier: Digikey Electronics
L4 = Inductor: Code_IEC: 1005; Published: 8-Jun-2000; LatestRevisionDate: 29-May-2009; LatestRevisionNote: IPC-7351 Footprint Added.; PackageReference: 0402-A; Publisher: Altium Limited; PackageDescription: Chip Inductor; Code_JEITA: 0402
PS1 = ULS-12/5-D48N-C: Isolated Module DC DC Converter 1 Output 12V - - 5A 36V - 75V Input; MF: Murata Power Solutions Inc.; Availability: In Stock; SnapEDA_Link: https://www.snapeda.com/parts/ULS-12/5-D48N-C/Murata/view-part/?ref=snap; Purchase-URL: https://pricing.snapeda.com/search/part/ULS-12/5-D48N-C/?ref=eda; Price: None; Check_prices: https://www.snapeda.com/parts/ULS-12/5-D48N-C/Murata/view-part/?ref=eda; Package: None; MP: ULS-12/5-D48N-C; Value: *; ComponentLink1Description: New link; ComponentLink1URL: VOUT-
Q1 Q5 Q6 Q10 = MOSFET-P: Supplier: Digikey Electronics
Q2 Q3 Q7 Q8 = MOSFET-N: Supplier: Digikey Electronics
Q4 = Diode-SOT23-3: Supplier: Digikey Electronics
Q9 = CMP-1259-00083-1: N-Channel Trench MOSFET, 60 V, 0.35 A, -55 to 150 degC, 3-Pin SOT23, Tape and Reel; Manufacturer: NXP Semiconductors; Automotive Qualified: Y; Channel Type: N; ID [max] (A): 0.35; Packing: Tape & Reel; IDM [max] (A): 1.2; VGSth [typ] (V): 1.6; VDS [max] (V): 60; ComponentLink1URL: http://www.nxp.com/; ComponentLink2URL: http://www.nxp.com/documents/data_sheet/2N7002BK.pdf; ComponentLink3Description: Package Specification; PackageVersion: 06-03-16, 03/2006; DatasheetVersion: Rev. 1; PackageReference: SOT23; PartNumber: 2N7002BK,215; Code_JEDEC: TO-236AB; ComponentLink1Description: Manufacturer URL; ComponentLink3URL: http://www.nxp.com/documents/outline_drawing/sot023_po.pdf; ComponentLink2Description: Datasheet; PackageDescription: 3-Pin Small Outline Transistor Package, Body 2.9 x 1.3 mm, Pitch 0.95 mm; Mounting Technology: Surface Mount
Q11 Q12 = 2N3904: NPN General Purpose Amplifier; Published: 8-Jun-2000; LatestRevisionDate: 15-Jan-2003; LatestRevisionNote: PCB Footprint 'BCY-W3/D4.7' replaced; DatasheetVersion: 1997; PackageVersion: Sep-1998; PackageReference: TO-92A; Publisher: Altium Limited; PackageDescription: TO, Flat Index; 3 In-Line, Axial Leads; Body Dia. 4.5mm; Leads 0.51 x 0.48 mm (max); ComponentLink1Description: Manufacturer Link; ComponentLink1URL: http://www.fairchildsemi.com/; ComponentLink2Description: Datasheet; ComponentLink2URL: http://www.fairchildsemi.com/ds/2N%2F2N3904.pdf
R5 R6 R10 R11 R34 R35 R37-R44 R68-R71 = Resistor: RES SMD 15K OHM 1% 1/16W 0402; Mfr. Part No.: MCR01MZPF1502; Value: 15k 1%; Unit Price (USD): 0.1; Supplier Part No.: RHM15.0KLTR-ND; Supplier: Digikey Electronics
R14 = Resistor: RES SMD 51 OHM 0.5% 1/16W 0402; Mfr. Part No.: ERA-2AED510X; Value: 51R; Unit Price (USD): 0.21; Supplier Part No.: P51DECT-ND; Supplier: Digikey Electronics
R45-R48 R51-R53 R55-R59 R61-R67 R82-R87 = Resistor: Semiconductor Resistor; Published: 8-Jun-2000; LatestRevisionDate: 17-Jul-2002; LatestRevisionNote: Re-released for DXP Platform.; PackageReference: AXIAL-0.5; Publisher: Altium Limited; PackageDescription: Axial Device, Thru-Hole; 2 Leads; 0.5 in Pin Spacing
  R82-R87: Value: 1K
R50 = CMP-26527-006700-1: 2Ω ±5% 1W 2512 Thick Film Chip Resistor AEC-Q200 compliant; Temperature Coefficient: 400ppm/°C; Resistance: 2R; Resistor Type: Thick Film; Max Power Dissipation: 1W; Lead Free: Lead Free; Length: 0.248inch; Size Code: 2512; Min Operating Temperature: -55°C; Mount: Surface Mount; Width: 0.126inch; Features: Automotive AEC-Q200; Depth: 3.2mm; Max Operating Temperature: 155°C; Height: 0.028inch; Number of Terminations: 2; Military Standard: Not; Case Code (Imperial): 2512; Case Code (Metric): 6432; Contact Plating: Tin; Power Rating: 1W; Series: RMCF; Construction: Rectangular; Tolerance: 5%; Case/Package: 2512; RoHS Compliant: Yes; Packaging: Tape and Reel; Radiation Hardening: No
R54 = Res1: Resistor; Published: 8-Jun-2000; LatestRevisionDate: 17-Jul-2002; LatestRevisionNote: Re-released for DXP Platform.; PackageReference: AXIAL-0.3; Publisher: Altium Limited; PackageDescription: Axial Device, Thru-Hole; 2 Leads; 0.3 in Pin Spacing; Value: 1K
RAC RSR1 = CMP-2000-07418-1: Chip Resistor, 10 mOhm, +/- 1%, 0.5 W, -65 to 170 degC, 2010 (5025 Metric), RoHS, Tape and Reel; Manufacturer: Vishay; Unit Weight: 0.001372oz; Temperature Coefficient: 75PPM/C; Case Width: 2.5mm; Case Length: 5mm; Resistance: 0.01Ohms; Case Height: 0.635mm; Brand: Vishay/Dale; Power Rating: 500mW(1/2W); Datasheet Version: 07/2016; Package Reference: 2010; Factory Pack Quantity: 4000; Manufacturer URL: http://www.vishay.com/; Series: WSL; Operating Temperature Range: -65Cto+170C; Mounting Technology: SurfaceMount; Package Description: 2-Pin Surface Mount Device, Body 5.08 x 2.54 mm; Product Category: CurrentSenseResistors-SMD; Type: PowerMetalStripResistors,LowValue(downto0.0005Ohms),SurfaceMount; Product: MetalElementCurrentSensingResistors; Datasheet URL: http://www.vishay.com/docs/30100/wsl.pdf; Package / Case: 2010(5025metric); Packaging: Reel; Termination Style: SMD/SMT; Case Code - mm: 5025; Case Code - in: 2010; RoHS: Details; Tradename: PowerMetalStrip; Tolerance: 1%
RT1 = Header 1x2: CONN HEADER VERT 3POS 2.54MM; Mfr. Part No.: 75160-156-03LF; Value: 51R; Unit Price (USD): 0.74; Supplier Part No.: 609-75160-156-03LF-ND; Supplier: Digikey Electronics
U3 = TPS2372-3RGWR: No Description Available; Mfr_Name: Texas Instruments; Type: DEV; RefDes: RefDes; Copyright: Copyright (C) 2023 Ultra Librarian. All rights reserved.; Manufacturer_Part_Number: TPS2372-3RGWR
U12 = CMP-2000-05058-1: DC Input, Half-Pitch Phototransistor Optocoupler, 5 V, -55 to 110 degC, 4-Pin SOIC, RoHS, Tape and Reel; Configuration: 1Channel; Current Transfer Ratio: 600%; Maximum Reverse Diode Voltage: 6V; Maximum Collector Emitter Voltage: 80V; Maximum Rise Time: 2us; Maximum Forward Diode Voltage: 1.4V; Brand: AvagoTechnologies; Output Device: NPNPhototransistor; Maximum Input Diode Current: 50mA; Maximum Fall Time: 3us; Maximum Power Dissipation: 200mW; Isolation Voltage: 3000Vrms; Maximum Collector Emitter Saturation Voltage: 0.4V; Maximum Operating Temperature: +110C; Package Description: 4-Pin Small Outline Integrated Circuits, Body 4.4 x 2.6 mm, Pitch 1.27 mm; Product Category: TransistorOutputOptocouplers; Factory Pack Quantity: 3000; Packaging: Reel; Output Type: DC; Manufacturer URL: http://www.avagotech.com/; Package Reference: SOIC-4; Number of Channels: 1Channel; Datasheet Version: Aug-11; Package / Case: SOIC-4; Maximum Collector Current: 50mA; Datasheet URL: https://datasheet.ciiva.com/15118/getdatasheetpartid-243403-15118938.pdf; Input Type: DC; RoHS: Details; Number of Channels per Chip: 1Channel; Minimum Operating Temperature: -55C; Manufacturer: AvagoTechnologies
U16 = bq24616
C81-C92 C96-C101 Cff1 Cttc = Capacitor: Published: 8-Jun-2000; LatestRevisionDate: 17-Jul-2002; LatestRevisionNote: Re-released for DXP Platform.; PackageReference: RAD-0.3; Publisher: Altium Limited; PackageDescription: Radial Cap, Thru-Hole; 2 Leads; 0.3 in Pin Spacing
J19 = T-BLOCK-1x2: Supplier: Digikey Electronics

## Nets that join several sheets
3V3: Sheet1 (C40.1 U24.13), Sheet2 (J23.2 J23.4 J23.6)
12V_SYS: Sheet2 (19 pins), Sheet4 (5 pins), Sheet5 (9 pins)
+1.8V: Sheet1 (J1.88 J1.90 R2.2), Sheet2 (A1.10 C153.1)
+3.3V: Sheet1 (14 pins), Sheet2 (17 pins), Sheet3 (C140.1 U25.1 U25.2 U25.24), Sheet4 (43 pins)
+5V: Sheet1 (18 pins), Sheet2 (14 pins)
GND: Sheet1 (131 pins), Sheet2 (113 pins), Sheet3 (34 pins), Sheet4 (47 pins), Sheet5 (29 pins)
P_VDD: Sheet3 (5 pins), Sheet5 (14 pins)
AIN0: Sheet1 (J1.96), Sheet2 (J10.5)
AIN1: Sheet1 (J1.94), Sheet2 (J10.6)
BT-nDis: Sheet1 (J1.91), Sheet2 (J13.3)
CAM-GPIO: Sheet1 (J1.97), Sheet2 (J23.9)
DISABLE_POE_DCDC: Sheet1 (J1.48), Sheet5 (U12.4)
EEPROM-nWP: Sheet1 (J1.20), Sheet2 (J10.4)
Global-EN: Sheet1 (J1.99), Sheet2 (J10.14 J12.1 U7.4)
HD7_N: Sheet1 (U5.37), Sheet2 (FL5.A2)
HD7_P: Sheet1 (U5.38), Sheet2 (FL5.A1)
ID-SC: Sheet1 (J1.35), Sheet2 (J23.1)
ID-SD: Sheet1 (J1.36), Sheet2 (J23.3)
IO4: Sheet1 (J1.54), Sheet2 (U23.4)
IO5: Sheet1 (J1.34), Sheet2 (U23.1)
IO8: Sheet1 (J1.39), Sheet2 (U22.4)
IO9: Sheet1 (J1.40), Sheet2 (U22.1)
IO10: Sheet1 (J1.44), Sheet2 (U22.2 U22.3)
IO11: Sheet1 (J1.38), Sheet2 (U23.2 U23.3)
IO13: Sheet1 (J1.28), Sheet2 (J23.7)
IO14: Sheet1 (J1.55), Sheet2 (J14.11)
IO15: Sheet1 (J1.51), Sheet2 (J14.13)
IO16: Sheet1 (J1.29), Sheet2 (J14.23)
IO17: Sheet1 (J1.50), Sheet2 (J14.25)
LAN_RST: Sheet1 (J1.30), Sheet4 (C137.1 R138.1 U13.91)
M.2_OFF/ON: Sheet1 (J1.45), Sheet2 (J6.6)
M.2_RST: Sheet1 (J1.31), Sheet2 (R80.2)
M.2_W_DIS: Sheet1 (J1.41), Sheet2 (J6.8)
nRPI-BOOT: Sheet1 (J1.93), Sheet2 (J10.2)
P0LED1: Sheet3 (R104.1), Sheet4 (R126.1 U13.85)
P0LED2: Sheet3 (J9.17 J9.20), Sheet4 (R117.1 U13.84)
P1LED1: Sheet3 (R31.1), Sheet4 (R127.1 U13.83)
P1LED2: Sheet3 (D4.1 D21.2), Sheet4 (R116.1 U13.81)
P2LED1: Sheet3 (R106.1), Sheet4 (R129.1 U13.80)
P2LED2: Sheet3 (J18.11 J18.14), Sheet4 (R130.1 U13.78)
PR12: Sheet3 (J9.13), Sheet5 (CD1.2)
PR36: Sheet3 (J9.14), Sheet5 (CD1.3)
PR45: Sheet3 (J9.15), Sheet5 (CD2.2)
PR78: Sheet3 (J9.16), Sheet5 (CD2.3)
RUN-PG: Sheet1 (J1.92), Sheet2 (J12.3 U8.2)
SCL0: Sheet1 (J1.80), Sheet2 (U9.2)
SCL1: Sheet1 (J1.56), Sheet2 (A1.4 R32.2)
SCL6: Sheet1 (J1.47 R109.2), Sheet2 (P2.2 U6.6)
SDA0: Sheet1 (J1.82), Sheet2 (U9.1)
SDA1: Sheet1 (J1.58), Sheet2 (A1.2 R33.2)
SDA6: Sheet1 (J1.46 R108.2), Sheet2 (P2.1 U6.5)
SYNC-IN: Sheet1 (J1.16), Sheet2 (J10.8)
SYNC-OUT: Sheet1 (J1.18), Sheet2 (J10.9)
T/R: Sheet1 (J1.37), Sheet2 (R88.2)
TRD0_0_N: Sheet3 (D31.4 D31.7 J9.10), Sheet4 (U13.98)
TRD0_0_P: Sheet3 (D31.5 D31.6 J9.11), Sheet4 (U13.97)
TRD0_1_N: Sheet3 (D29.5 D29.6 J9.5), Sheet4 (U13.100)
TRD0_1_P: Sheet3 (D29.4 D29.7 J9.4), Sheet4 (U13.99)
TRD0_2_N: Sheet3 (D29.1 D29.10 J9.2), Sheet4 (U13.103)
TRD0_2_P: Sheet3 (D29.2 D29.9 J9.3), Sheet4 (U13.102)
TRD0_3_N: Sheet3 (D31.2 D31.9 J9.9), Sheet4 (U13.105)
TRD0_3_P: Sheet3 (D31.1 D31.10 J9.8), Sheet4 (U13.104)
TRD1_0_N: Sheet3 (D32.2 D32.9 T1.3), Sheet4 (U13.108)
TRD1_0_P: Sheet3 (D32.1 D32.10 T1.2), Sheet4 (U13.107)
TRD1_1_N: Sheet3 (D32.5 D32.6 T1.6), Sheet4 (U13.110)
TRD1_1_P: Sheet3 (D32.4 D32.7 T1.5), Sheet4 (U13.109)
TRD1_2_N: Sheet3 (D33.2 D33.9 T1.9), Sheet4 (U13.113)
TRD1_2_P: Sheet3 (D33.1 D33.10 T1.8), Sheet4 (U13.112)
TRD1_3_N: Sheet3 (D33.4 D33.7 T1.11), Sheet4 (U13.115)
TRD1_3_P: Sheet3 (D33.5 D33.6 T1.12), Sheet4 (U13.114)
TRD2_0_N: Sheet3 (D28.2 D28.9 J18.9), Sheet4 (U13.128)
TRD2_0_P: Sheet3 (D28.1 D28.10 J18.5), Sheet4 (U13.127)
TRD2_1_N: Sheet3 (D28.5 D28.6 J18.8), Sheet4 (U13.126)
TRD2_1_P: Sheet3 (D28.4 D28.7 J18.4), Sheet4 (U13.125)
TRD2_2_N: Sheet3 (D30.2 D30.9 J18.7), Sheet4 (U13.123)
TRD2_2_P: Sheet3 (D30.1 D30.10 J18.3), Sheet4 (U13.122)
TRD2_3_N: Sheet3 (D30.5 D30.6 J18.6), Sheet4 (U13.121)
TRD2_3_P: Sheet3 (D30.4 D30.7 J18.2), Sheet4 (U13.120)
TRD3_0_N: Sheet1 (J1.10), Sheet4 (U13.3)
TRD3_0_P: Sheet1 (J1.12), Sheet4 (U13.2)
TRD3_1_N: Sheet1 (J1.6), Sheet4 (U13.5)
TRD3_1_P: Sheet1 (J1.4), Sheet4 (U13.4)
TRD3_2_N: Sheet1 (J1.9), Sheet4 (U13.8)
TRD3_2_P: Sheet1 (J1.11), Sheet4 (U13.7)
TRD3_3_N: Sheet1 (J1.3), Sheet4 (U13.10)
TRD3_3_P: Sheet1 (J1.5), Sheet4 (U13.9)
TV-OUT: Sheet1 (J1.111), Sheet2 (J10.11)
WL-nDis: Sheet1 (J1.89), Sheet2 (J13.1)